# EAGLE schematic schematics_v10 (EAGLE 9.0.1)
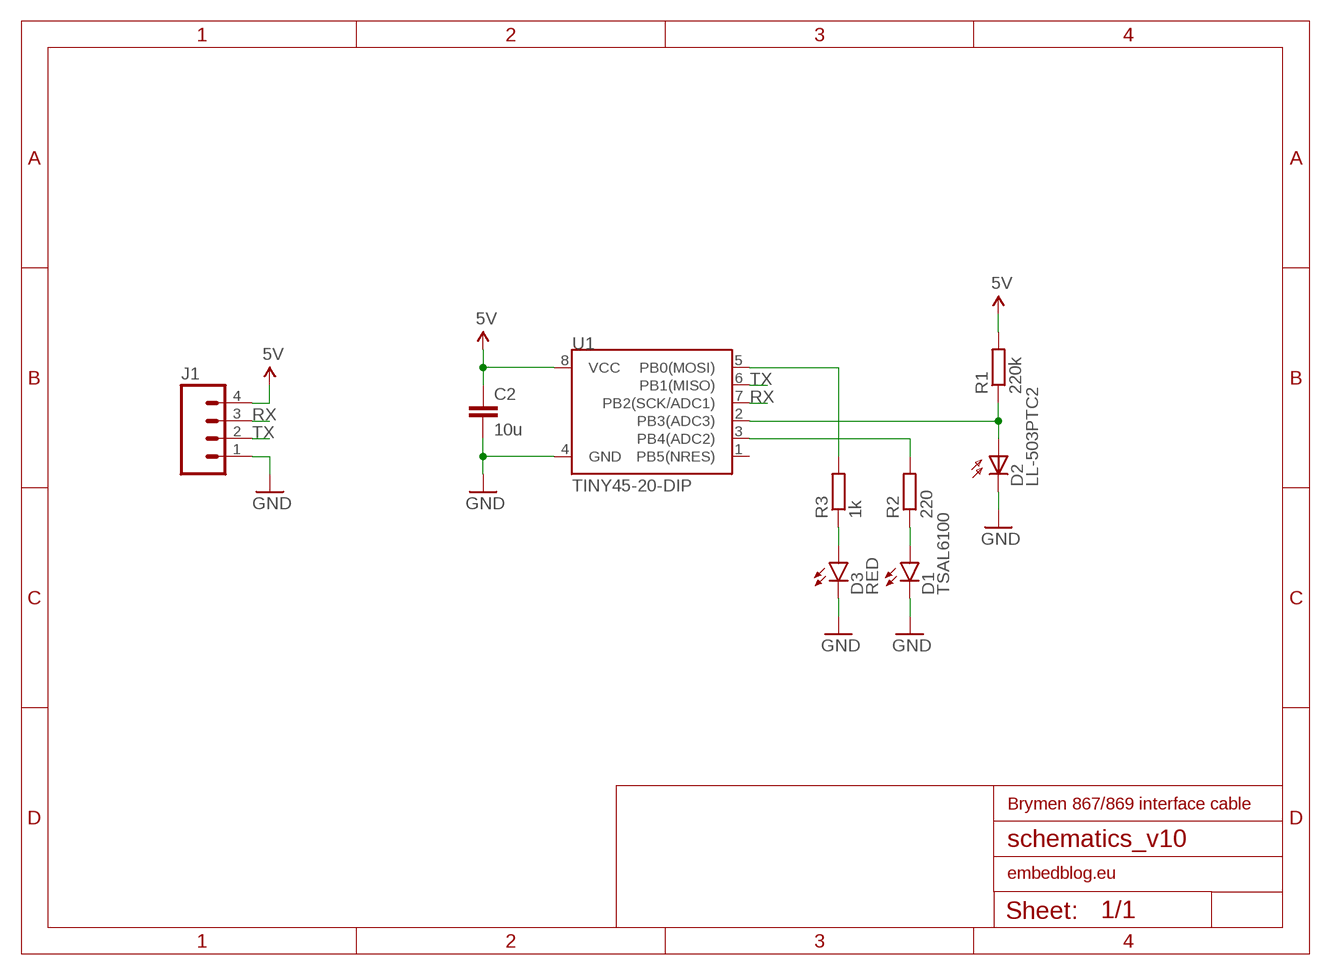
[diagram p0: schematic, sheet 1]

## Parts
C2  10u  C-EUC0805  [C0805]
D1  TSAL6100  LED5MM  [LED5MM]
D2  LL-503PTC2  BPX65  [BPX65]
D3  RED  LED5MM  [LED5MM]
J1  M04PTH  [1X04]
R1  220k  R-EU_R3216  [R3216]
R2  220  R-EU_R3216  [R3216]
R3  1k  R-EU_R3216  [R3216]
U1  TINY45-20-DIP  ATTINY45TINY45-20-DIP  [DIP08]

## Nets
5V: C2.1 J1.4 R1.2 U1.8(VCC)
GND: C2.2 D1.K(C) D2.K(C) D3.K(C) J1.1 U1.4(GND)
N$1: D2.A R1.1 U1.2(PB3(ADC3))
N$2: R2.2 U1.3(PB4(ADC2))
N$3: D1.A R2.1
N$4: R3.2 U1.5(PB0(MOSI))
N$5: D3.A R3.1
RX: J1.3 U1.7(PB2(SCK/ADC1))
TX: J1.2 U1.6(PB1(MISO))
Unconnected: U1.1(PB5(NRES))

## Notes on the sheet
- Brymen 867/869 interface cable
- embedblog.eu

## Library data of the parts
C2 = resistor:C-EU: CAPACITOR, European symbol
D1 D3 = SparkFun-LED:LED: LEDs Standard schematic elements and footprints for 5mm, 3mm, 1206, and 0603 sized LEDs. 5mm - Spark Fun Electronics SKU : COM-00529 (and others)
D2 = opto-trans-siemens:BPX65: PHOTO DIODE; MPN: BPX65.; OC_FARNELL: 327451; OC_NEWARK: 06WX2764
J1 = SparkFun-Connectors:M04: Header 4 Standard 4-pin 0.1" header. Use with straight break away headers (SKU : PRT-00116), right angle break away headers (PRT-00553), swiss pins (PRT-00743), machine pins (PRT-00117), and female headers (PRT-00115). Molex polarized connector foot print use with SKU : PRT-08231 with associated crimp pins and housings. 1MM SMD Version SKU: PRT-10208; PROD_ID: CONN-09696
R1-R3 = resistor:R-EU_: RESISTOR, European symbol
U1 = SparkFun-DigitalIC:ATTINY45: Atmel 8-pin 2/4/8kB flash uC; PROD_ID: IC-09439